# EAGLE schematic BitBeacon (EAGLE 7.3.0)
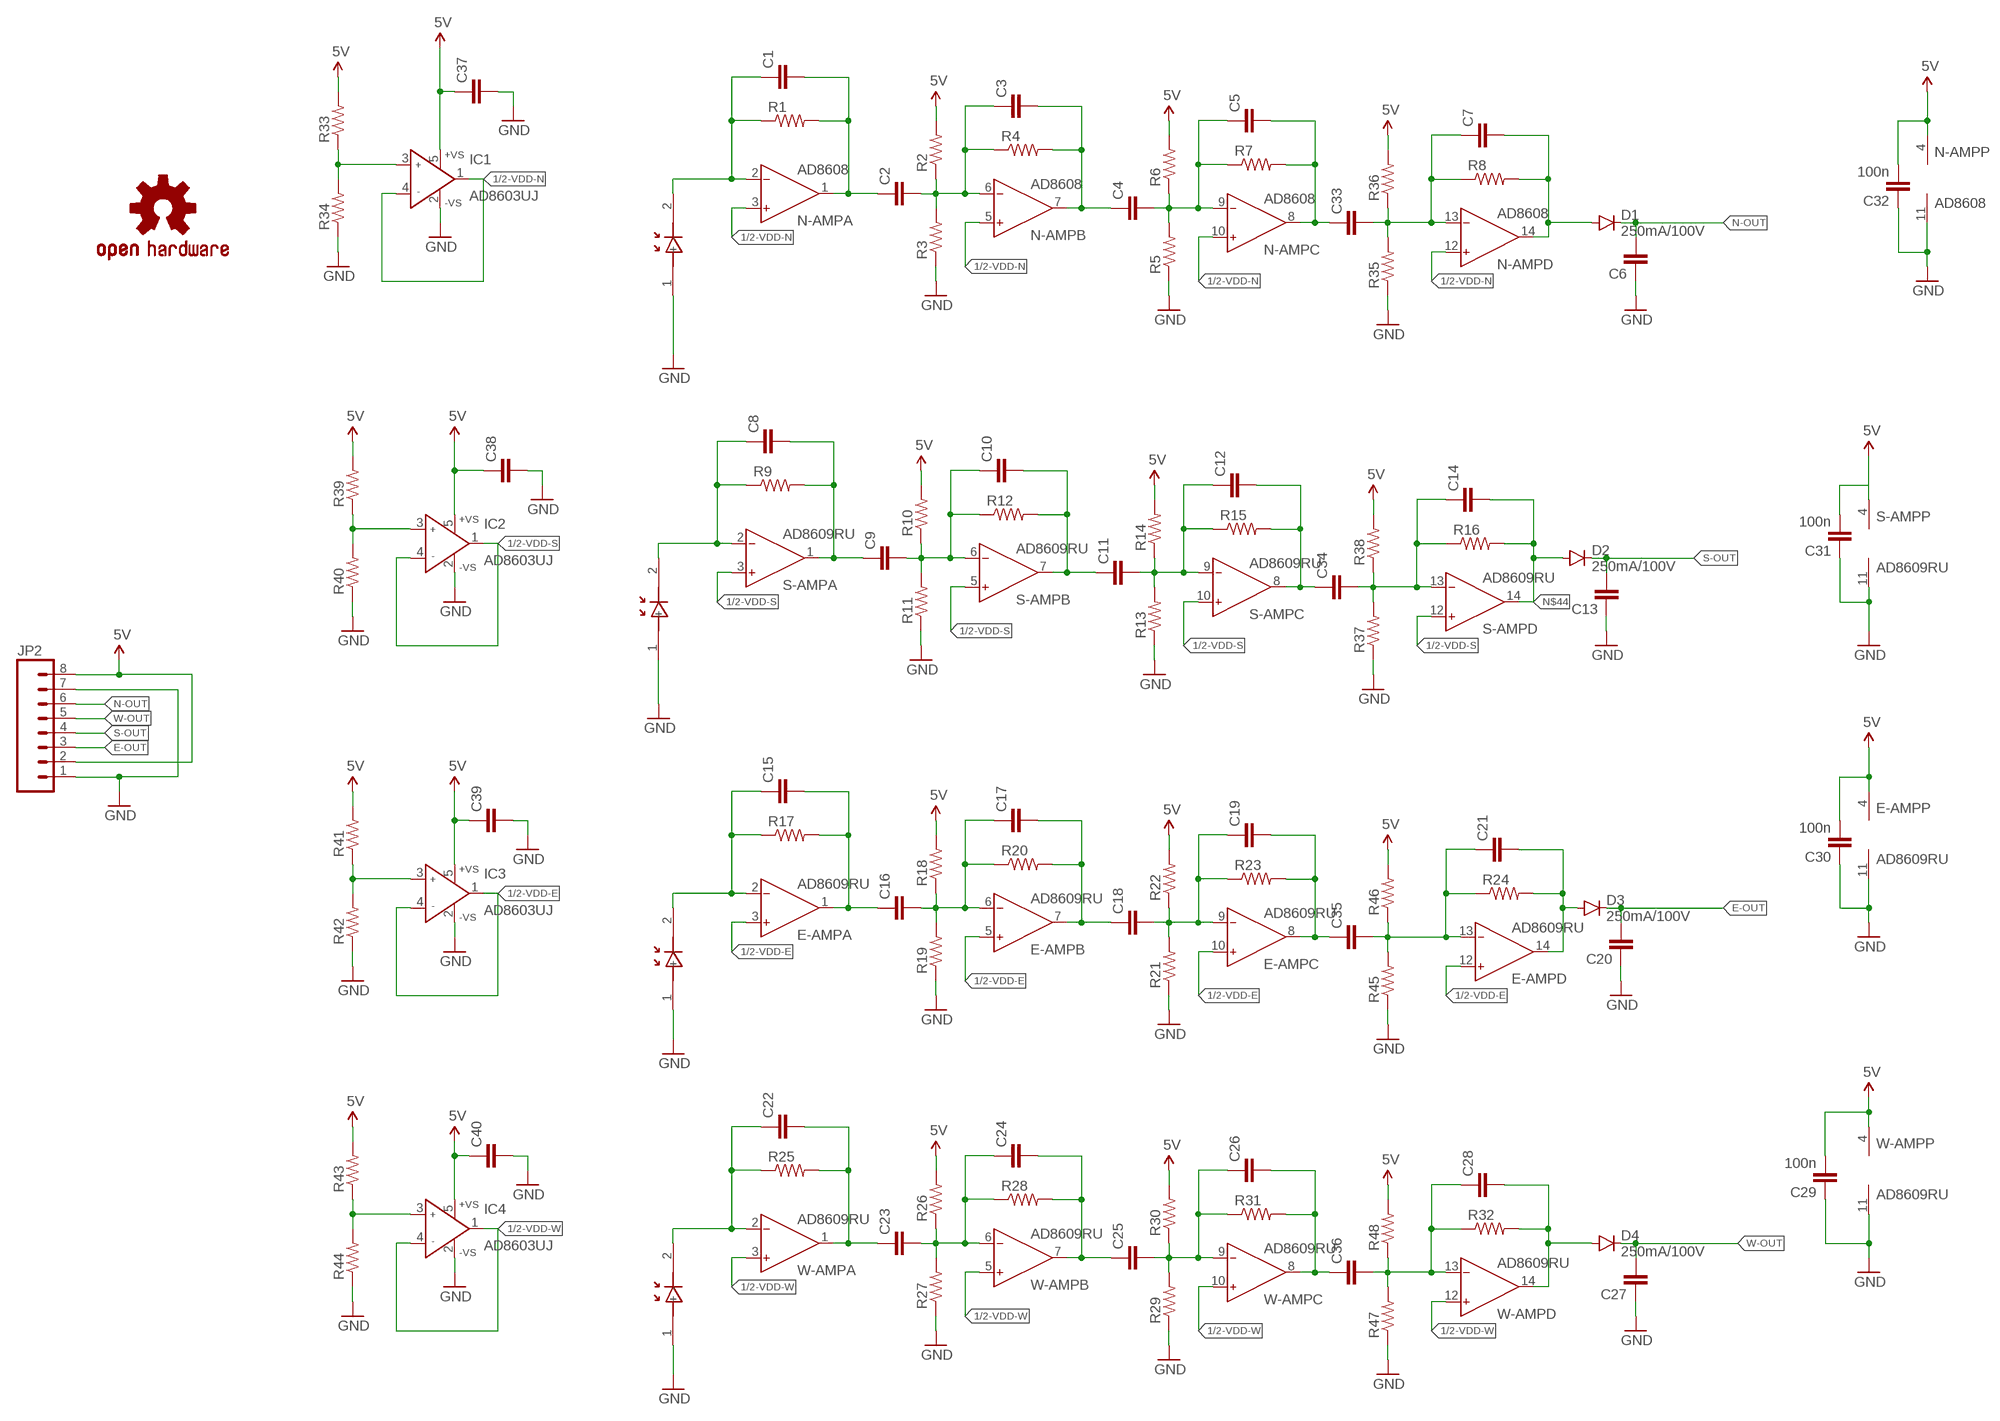
[diagram p0: schematic, sheet 1]

## Parts
C1  C-EUC0402  [C0402]
C2  C-EUC0402  [C0402]
C3  C-EUC0402  [C0402]
C4  C-EUC0402  [C0402]
C5  C-EUC0402  [C0402]
C6  C-EUC0402  [C0402]
C7  C-EUC0402  [C0402]
C8  C-EUC0402  [C0402]
C9  C-EUC0402  [C0402]
C10  C-EUC0402  [C0402]
C11  C-EUC0402  [C0402]
C12  C-EUC0402  [C0402]
C13  C-EUC0402  [C0402]
C14  C-EUC0402  [C0402]
C15  C-EUC0402  [C0402]
C16  C-EUC0402  [C0402]
C17  C-EUC0402  [C0402]
C18  C-EUC0402  [C0402]
C19  C-EUC0402  [C0402]
C20  C-EUC0402  [C0402]
C21  C-EUC0402  [C0402]
C22  C-EUC0402  [C0402]
C23  C-EUC0402  [C0402]
C24  C-EUC0402  [C0402]
C25  C-EUC0402  [C0402]
C26  C-EUC0402  [C0402]
C27  C-EUC0402  [C0402]
C28  C-EUC0402  [C0402]
C29  100n  C-EUC0402  [C0402]
C30  100n  C-EUC0402  [C0402]
C31  100n  C-EUC0402  [C0402]
C32  100n  C-EUC0402  [C0402]
C33  C-EUC0402  [C0402]
C34  C-EUC0402  [C0402]
C35  C-EUC0402  [C0402]
C36  C-EUC0402  [C0402]
C37  C-EUC0402  [C0402]
C38  C-EUC0402  [C0402]
C39  C-EUC0402  [C0402]
C40  C-EUC0402  [C0402]
D1  250mA/100V  DIODEBAS16  [SOD-323]
D2  250mA/100V  DIODEBAS16  [SOD-323]
D3  250mA/100V  DIODEBAS16  [SOD-323]
D4  250mA/100V  DIODEBAS16  [SOD-323]
E-AMP  AD8609RU  [TSSOP14]
E-PD1  BPW46  [PIN-PHOTODIODE]
IC1  AD8603UJ  [SOT23-5]
IC2  AD8603UJ  [SOT23-5]
IC3  AD8603UJ  [SOT23-5]
IC4  AD8603UJ  [SOT23-5]
JP2  M08NO_SILK  [1X08_PIN1_NO_SILK]
LOGO1  OSHW-LOGOS  [OSHW-LOGO-S]
N-AMP  AD8608  AD8609RU  [TSSOP14]
N-PD1  BPW46  [PIN-PHOTODIODE]
R1  R-US_R0402  [R0402]
R2  R-US_R0402  [R0402]
R3  R-US_R0402  [R0402]
R4  R-US_R0402  [R0402]
R5  R-US_R0402  [R0402]
R6  R-US_R0402  [R0402]
R7  R-US_R0402  [R0402]
R8  R-US_R0402  [R0402]
R9  R-US_R0402  [R0402]
R10  R-US_R0402  [R0402]
R11  R-US_R0402  [R0402]
R12  R-US_R0402  [R0402]
R13  R-US_R0402  [R0402]
R14  R-US_R0402  [R0402]
R15  R-US_R0402  [R0402]
R16  R-US_R0402  [R0402]
R17  R-US_R0402  [R0402]
R18  R-US_R0402  [R0402]
R19  R-US_R0402  [R0402]
R20  R-US_R0402  [R0402]
R21  R-US_R0402  [R0402]
R22  R-US_R0402  [R0402]
R23  R-US_R0402  [R0402]
R24  R-US_R0402  [R0402]
R25  R-US_R0402  [R0402]
R26  R-US_R0402  [R0402]
R27  R-US_R0402  [R0402]
R28  R-US_R0402  [R0402]
R29  R-US_R0402  [R0402]
R30  R-US_R0402  [R0402]
R31  R-US_R0402  [R0402]
R32  R-US_R0402  [R0402]
R33  R-US_R0402  [R0402]
R34  R-US_R0402  [R0402]
R35  R-US_R0402  [R0402]
R36  R-US_R0402  [R0402]
R37  R-US_R0402  [R0402]
R38  R-US_R0402  [R0402]
R39  R-US_R0402  [R0402]
R40  R-US_R0402  [R0402]
R41  R-US_R0402  [R0402]
R42  R-US_R0402  [R0402]
R43  R-US_R0402  [R0402]
R44  R-US_R0402  [R0402]
R45  R-US_R0402  [R0402]
R46  R-US_R0402  [R0402]
R47  R-US_R0402  [R0402]
R48  R-US_R0402  [R0402]
S-AMP  AD8609RU  [TSSOP14]
S-PD1  BPW46  [PIN-PHOTODIODE]
W-AMP  AD8609RU  [TSSOP14]
W-PD1  BPW46  [PIN-PHOTODIODE]

## Nets
1/2-VDD-E: E-AMP.3(A:IN+) E-AMP.5(B:IN+) E-AMP.10(C:IN+) E-AMP.12(D:IN+) IC3.1(OUT) IC3.4(IN-)
1/2-VDD-N: IC1.1(OUT) IC1.4(IN-) N-AMP.3(A:IN+) N-AMP.5(B:IN+) N-AMP.10(C:IN+) N-AMP.12(D:IN+)
1/2-VDD-S: IC2.1(OUT) IC2.4(IN-) S-AMP.3(A:IN+) S-AMP.5(B:IN+) S-AMP.10(C:IN+) S-AMP.12(D:IN+)
1/2-VDD-W: IC4.1(OUT) IC4.4(IN-) W-AMP.3(A:IN+) W-AMP.5(B:IN+) W-AMP.10(C:IN+) W-AMP.12(D:IN+)
5V: C29.2 C30.2 C31.2 C32.2 C37.1 C38.1 C39.1 C40.1 E-AMP.4(P:V+) IC1.5(+VS) IC2.5(+VS) IC3.5(+VS) IC4.5(+VS) JP2.2 JP2.8 N-AMP.4(P:V+) R2.2 R6.2 R10.2 R14.2 R18.2 R22.2 R26.2 R30.2 R33.2 R36.2 R38.2 R39.2 R41.2 R43.2 R46.2 R48.2 S-AMP.4(P:V+) W-AMP.4(P:V+)
E-OUT: C20.2 D3.C JP2.3
GND: C6.1 C13.1 C20.1 C27.1 C29.1 C30.1 C31.1 C32.1 C37.2 C38.2 C39.2 C40.2 E-AMP.11(P:V-) E-PD1.1(+) IC1.2(-VS) IC2.2(-VS) IC3.2(-VS) IC4.2(-VS) JP2.1 JP2.7 N-AMP.11(P:V-) N-PD1.1(+) R3.1 R5.1 R11.1 R13.1 R19.1 R21.1 R27.1 R29.1 R34.1 R35.1 R37.1 R40.1 R42.1 R44.1 R45.1 R47.1 S-AMP.11(P:V-) S-PD1.1(+) W-AMP.11(P:V-) W-PD1.1(+)
N$1: C1.1 N-AMP.2(A:IN-) N-PD1.2(-) R1.1
N$2: C14.1 C34.2 R16.1 R37.2 R38.1 S-AMP.13(D:IN-)
N$3: C1.2 C2.1 N-AMP.1(A:OUT) R1.2
N$4: C8.1 R9.1 S-AMP.2(A:IN-) S-PD1.2(-)
N$5: C2.2 C3.1 N-AMP.6(B:IN-) R2.1 R3.2 R4.1
N$6: C3.2 C4.1 N-AMP.7(B:OUT) R4.2
N$7: C4.2 C5.1 N-AMP.9(C:IN-) R5.2 R6.1 R7.1
N$8: C5.2 C33.1 N-AMP.8(C:OUT) R7.2
N$9: IC1.3(IN+) R33.1 R34.2
N$10: C7.1 C33.2 N-AMP.13(D:IN-) R8.1 R35.2 R36.1
N$11: C7.2 D1.A N-AMP.14(D:OUT) R8.2
N$12: C9.2 C10.1 R10.1 R11.2 R12.1 S-AMP.6(B:IN-)
N$13: C10.2 C11.1 R12.2 S-AMP.7(B:OUT)
N$14: C11.2 C12.1 R13.2 R14.1 R15.1 S-AMP.9(C:IN-)
N$15: C12.2 C34.1 R15.2 S-AMP.8(C:OUT)
N$16: IC2.3(IN+) R39.1 R40.2
N$17: IC3.3(IN+) R41.1 R42.2
N$18: IC4.3(IN+) R43.1 R44.2
N$19: C15.1 E-AMP.2(A:IN-) E-PD1.2(-) R17.1
N$20: C15.2 C16.1 E-AMP.1(A:OUT) R17.2
N$21: C16.2 C17.1 E-AMP.6(B:IN-) R18.1 R19.2 R20.1
N$22: C17.2 C18.1 E-AMP.7(B:OUT) R20.2
N$23: C18.2 C19.1 E-AMP.9(C:IN-) R21.2 R22.1 R23.1
N$24: C19.2 C35.1 E-AMP.8(C:OUT) R23.2
N$25: C28.1 C36.2 R32.1 R47.2 R48.1 W-AMP.13(D:IN-)
N$26: C21.1 C35.2 E-AMP.13(D:IN-) R24.1 R45.2 R46.1
N$28: C22.1 R25.1 W-AMP.2(A:IN-) W-PD1.2(-)
N$29: C22.2 C23.1 R25.2 W-AMP.1(A:OUT)
N$30: C23.2 C24.1 R26.1 R27.2 R28.1 W-AMP.6(B:IN-)
N$31: C24.2 C25.1 R28.2 W-AMP.7(B:OUT)
N$32: C25.2 C26.1 R29.2 R30.1 R31.1 W-AMP.9(C:IN-)
N$33: C26.2 C36.1 R31.2 W-AMP.8(C:OUT)
N$44: C14.2 D2.A R16.2 S-AMP.14(D:OUT)
N$46: C21.2 D3.A E-AMP.14(D:OUT) R24.2
N$47: C28.2 D4.A R32.2 W-AMP.14(D:OUT)
N-OUT: C6.2 D1.C JP2.6
S-AMP: C8.2 C9.1 R9.2 S-AMP.1(A:OUT)
S-OUT: C13.2 D2.C JP2.4
W-OUT: C27.2 D4.C JP2.5

## Library data of the parts
C1-C40 = resistor:C-EU: CAPACITOR, European symbol
D1-D4 = SparkFun-DiscreteSemi:DIODE: Diode These are standard reverse protection diodes and small signal diodes. SMA package can handle up to about 1A. SOD-323 can handle about 200mA. What the SOD-323 package when ordering, there are some mfgs out there that are 5-pin packages.; PROD_ID: DIO-09646
E-AMP N-AMP S-AMP W-AMP = analog-devices:AD8609: Precision Micropower, Low Noise CMOS, Rail-to-Rail Input/Output Operational Amplifiers Source: http://www.analog.com/static/imported-files/data_sheets/AD8603_8607_8609.pdf; MF: ALTERA CORPORATION; MPN: AD8609ARUZ; OC_FARNELL: 1464994; OC_NEWARK: 59K6934
E-PD1 N-PD1 S-PD1 W-PD1 = Orlando:BPW46
IC1-IC4 = analog-devices:AD8603: Precision Micropower, Low Noise CMOS, Rail-to-Rail Input/Output Operational Amplifiers Source: http://www.analog.com/static/imported-files/data_sheets/AD8603_8607_8609.pdf; MF: ALTERA CORPORATION; MPN: AD8603AUJZ-REEL7; OC_FARNELL: 1651290; OC_NEWARK: 59K6904
JP2 = SparkFun-Connectors:M08: Header 8 Standard 8-pin 0.1" header. Use with straight break away headers (SKU : PRT-00116), right angle break away headers (PRT-00553), swiss pins (PRT-00743), machine pins (PRT-00117), and female headers (PRT-00115).
LOGO1 = SparkFun-Aesthetics:OSHW-LOGO: Open Source Hardware Logo This logo indicates the piece of hardware it is found on incorporates a OSHW license and/or adheres to the definition of open source hardware found here: http://freedomdefined.org/OSHW
R1-R48 = resistor:R-US_: RESISTOR, American symbol